# EAGLE schematic Voltage_Amp (EAGLE 9.6.1)
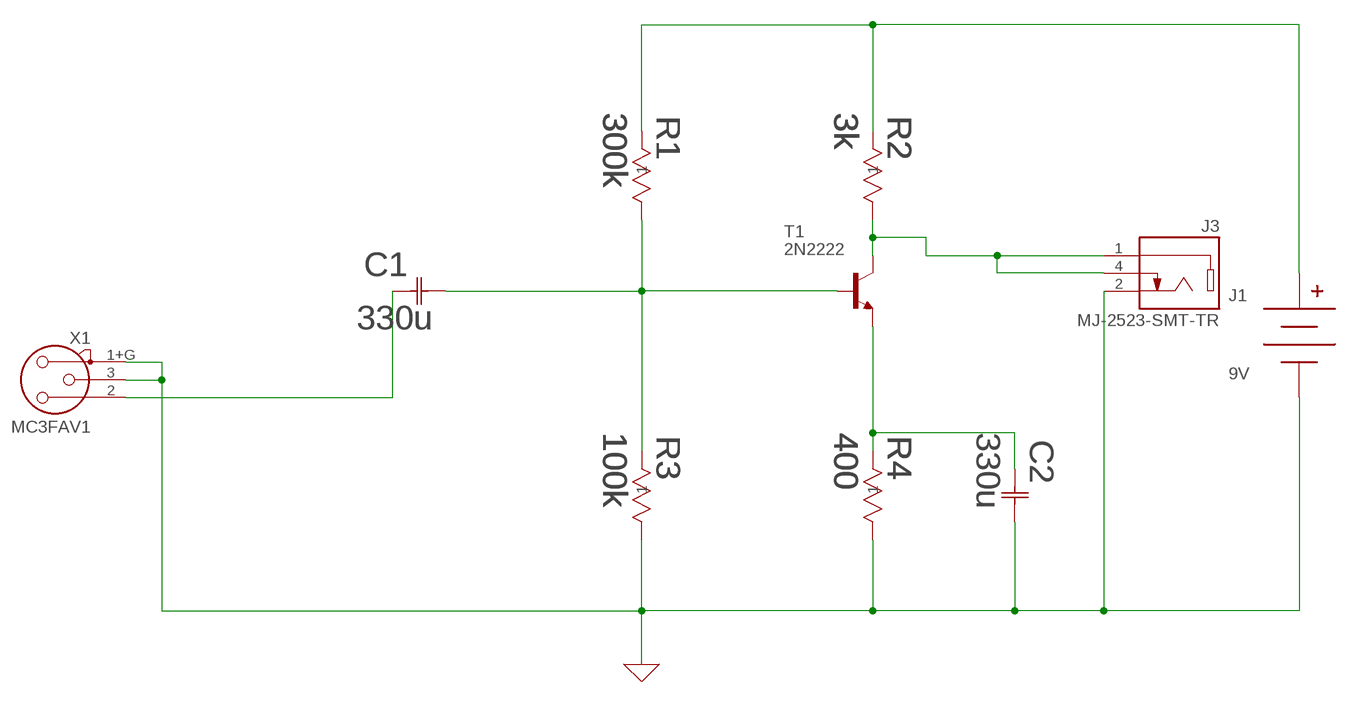
[diagram p0: schematic, sheet 1]

## Parts
C1  330u  UKZ1E331MHM  [U1-Z_NCH]
C2  330u  UKZ1E331MHM  [U1-Z_NCH]
J1  9V  BC9VPC  [BC9VPC]
J3  MJ-2523-SMT-TR  [MJ-2523-SMT-TR]
R1  300k  RN55E3003BB14  [CMF55]
R2  3k  RN55C3001BB14  [CMF55]
R3  100k  RN55E1003BB14  [CMF55]
R4  400  RN55E4000BRE6  [CMF55]
T1  2N2222  [TO18]
X1  MC3FAV1  [NC3FAV1]

## Nets
0: C2.2 J1.V- J3.2(TIP) R3.2 R4.2 X1.1+G X1.3 ; supply symbol labelled GND
N$1: C1.2 R1.2 R3.1 T1.2(B)
N$2: J1.V+ R1.1 R2.1
N$3: J3.1(SLEEVE) J3.4(TIP_SWITCH) R2.2 T1.3(C)
N$4: C2.1 R4.1 T1.1(E)
N$5: C1.1 X1.2

## Library data of the parts
C1 C2 = Aud_AMP:UKZ1E331MHM; BUILT_BY: EMA_UL_Team; MANUFACTURER_PART_NUMBER: UKZ1E331MHM; SOURCELIBRARY: Nichicon_2014-12-31; VENDOR: Nichicon
J1 = SparkFun-Connectors:BC9VPC: 9V Battery Holder - PC Mount Standard and Kit footprints included SparkFun Products: SparkFun SparkPunk Sound Kit <https://www.sparkfun.com/products/11177> SparkFun SparkPunk Sequencer Kit <https://www.sparkfun.com/products/12707>; PROD_ID: BATT-10855
J3 = Audio Connectors:MJ-2523-SMT-TR: CONN JACK MONO 2.5MM SMD R/A Manufacturer's datasheet <https://www.cuidevices.com/product/resource/mj-2523-smt-tr.pdf>; CREATED_BY: PCBLayout.com; DIGIKEY_PN: CP-2523MJTR-ND; MANUFACTURER: CUI Devices; MPN: MJ-2523-SMT-TR
R1 = Aud_AMP:RN55E3003BB14; BUILT_BY: EMA_UL_Team; MANUFACTURER_PART_NUMBER: RN55E3003BB14; VENDOR: Vishay
R2 = Aud_AMP:RN55C3001BB14; BUILT_BY: EMA_UL_Team; MANUFACTURER_PART_NUMBER: RN55C3001BB14; VENDOR: Vishay
R3 = Aud_AMP:RN55E1003BB14; BUILT_BY: EMA_UL_Team; MANUFACTURER_PART_NUMBER: RN55E1003BB14; VENDOR: Vishay
R4 = Aud_AMP:RN55E4000BRE6; BUILT_BY: EMA_UL_Team; MANUFACTURER_PART_NUMBER: RN55E4000BRE6; VENDOR: Vishay
T1 = transistor:2N2222: NPN TRANSISTOR
X1 = con-neutrik_ag:MC3?: Neutrik Audio Connector XLR SERIES Stereo 1/4" jack Source: www.neutrik.com/; OC_FARNELL: unknown; OC_NEWARK: unknown